# Altium schematic sheet Dome Control.SchDoc
size A4; Organization: Deutsches Zentrum für Luft-; Address1: und Raumfahrt e.V. (DLR); Address2: Institut für Materialphysik; Address3: im Weltraum; Address4: Linder Höhe - 51147 Köln; DocumentNumber: 4; SheetNumber: 4; SheetTotal: 4
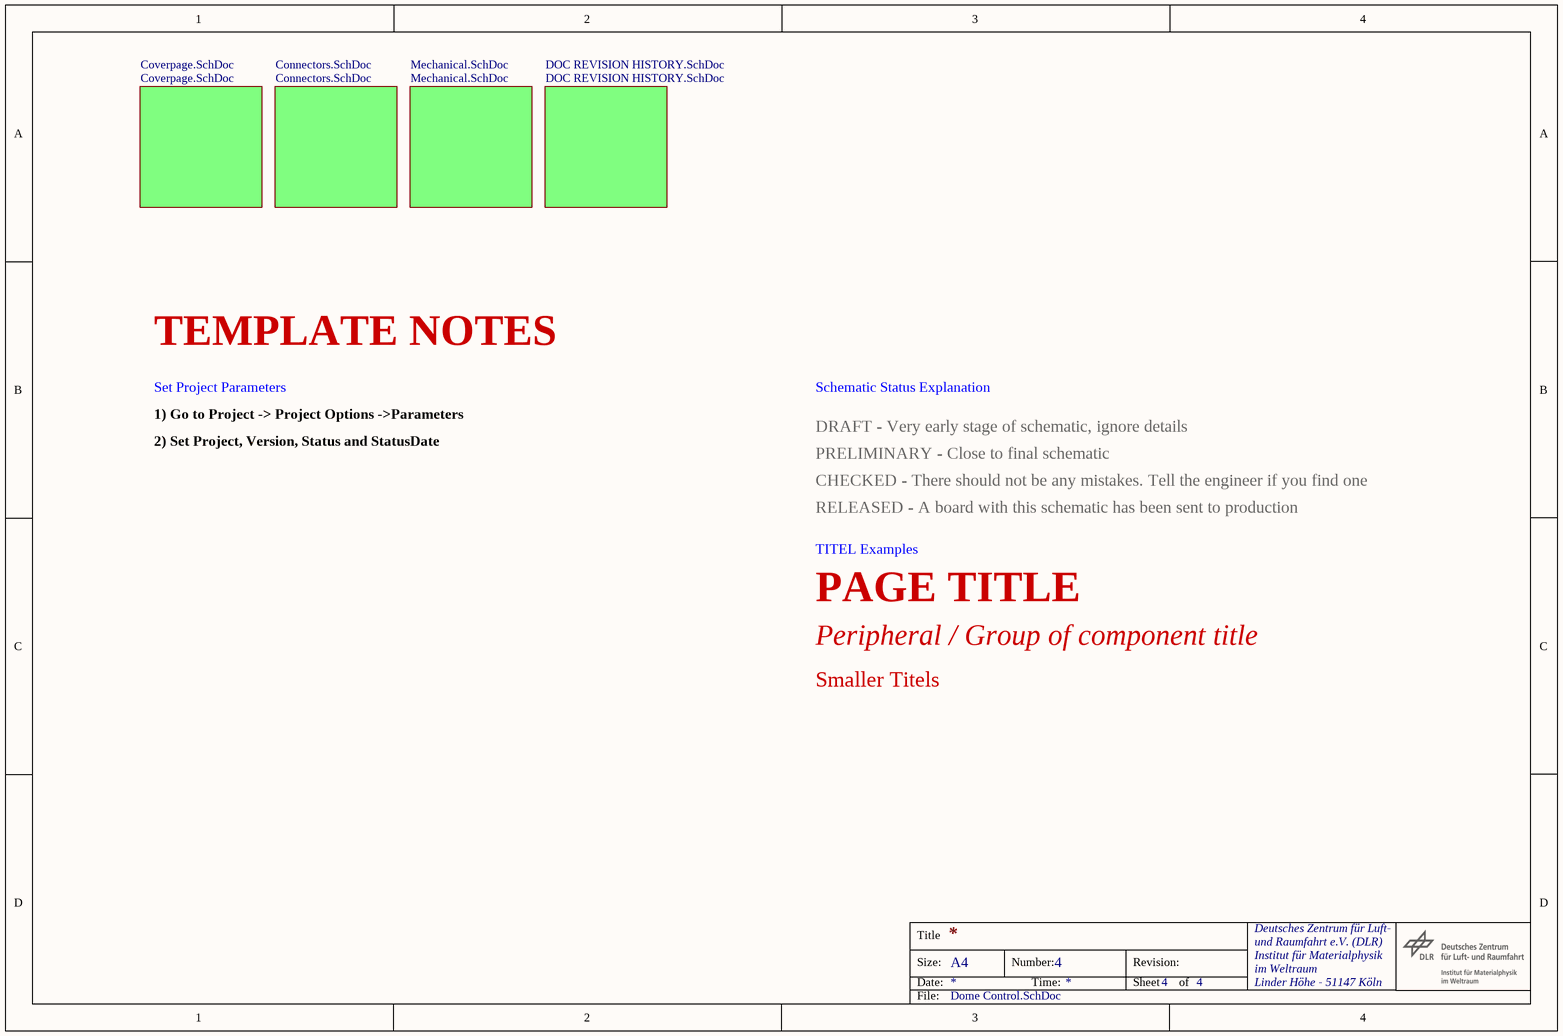
[diagram p0: Dome Control.SchDoc]

## Sub-sheets
Connectors.SchDoc = Connectors.SchDoc: no entries
Coverpage.SchDoc = Coverpage.SchDoc: no entries
DOC REVISION HISTORY.SchDoc = DOC REVISION HISTORY.SchDoc: no entries
Mechanical.SchDoc = Mechanical.SchDoc: no entries

## Notes on the sheet
- TEMPLATE NOTES
- Set Project Parameters
- 1) Go to Project -> Project Options ->Parameters
- 2) Set Project, Version, Status and StatusDate
- Schematic Status Explanation
- DRAFT - Very early stage of schematic, ignore details
- PRELIMINARY - Close to final schematic
- CHECKED - There should not be any mistakes. Tell the engineer if you find one
- RELEASED - A board with this schematic has been sent to production
- TITEL Examples
- PAGE TITLE
- Peripheral / Group of component title
- Smaller Titels
- Title
- Size:
- Date:
- A4
- Number:
- Time:
- Revision:
- Sheet
- of
- File: